# Altium schematic sheet 05_PWMdriver.SchDoc
size A
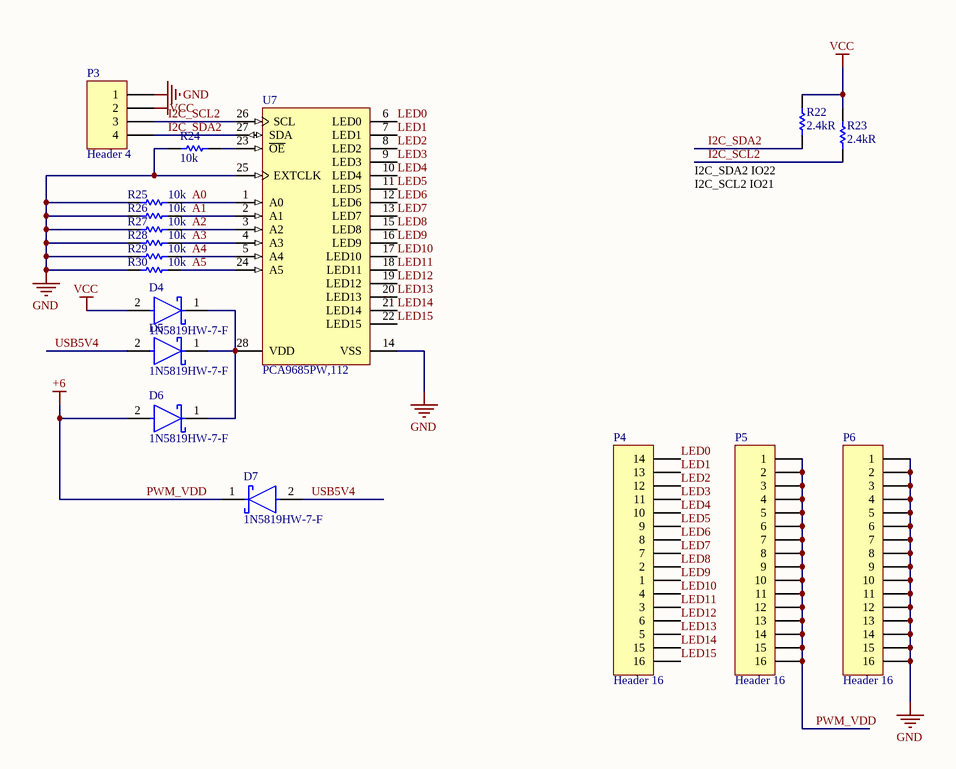
[diagram p0: 05_PWMdriver.SchDoc]

## Parts
D4  1N5819HW-7-F  [FP-SOD123-MFG]
D5  1N5819HW-7-F  [FP-SOD123-MFG]
D6  1N5819HW-7-F  [FP-SOD123-MFG]
D7  1N5819HW-7-F  [FP-SOD123-MFG]
P3  Header 4  [HDR1X4]
P4  Header 16  [HDR1X16]
P5  Header 16  [HDR1X16]
P6  Header 16  [HDR1X16]
R22  value 2.4kR  [RESC1608X50X30ML20T20]  (hidden comment: RR0816P-242-D)
R23  value 2.4kR  [RESC1608X50X30ML20T20]  (hidden comment: RR0816P-242-D)
R24  value 10k  [RESC1609X55X30LL15T15]  (hidden comment: ERJ3EKF1002V)
R25  value 10k  [RESC1609X55X30LL15T15]  (hidden comment: ERJ3EKF1002V)
R26  value 10k  [RESC1609X55X30LL15T15]  (hidden comment: ERJ3EKF1002V)
R27  value 10k  [RESC1609X55X30LL15T15]  (hidden comment: ERJ3EKF1002V)
R28  value 10k  [RESC1609X55X30LL15T15]  (hidden comment: ERJ3EKF1002V)
R29  value 10k  [RESC1609X55X30LL15T15]  (hidden comment: ERJ3EKF1002V)
R30  value 10k  [RESC1609X55X30LL15T15]  (hidden comment: ERJ3EKF1002V)
U7  PCA9685PW,112  [SOT361-1_V]

## Nets
GND: P3.1 P6.1 P6.2 P6.3 P6.4 P6.5 P6.6 P6.7 P6.8 P6.9 P6.10 P6.11 P6.12 P6.13 P6.14 P6.15 P6.16 R24.2 R25.2 R26.2 R27.2 R28.2 R29.2 R30.2 U7.14(VSS) U7.25(EXTCLK)
PWM_VDD: D6.2(A) D7.1(C) P5.1 P5.2 P5.3 P5.4 P5.5 P5.6 P5.7 P5.8 P5.9 P5.10 P5.11 P5.12 P5.13 P5.14 P5.15 P5.16  [also labelled +6]
VCC: D4.2(A) P3.2 R22.2 R23.2
A0: R25.1 U7.1(A0)
A1: R26.1 U7.2(A1)
A2: R27.1 U7.3(A2)
A3: R28.1 U7.4(A3)
A4: R29.1 U7.5(A4)
A5: R30.1 U7.24(A5)
I2C_SCL2: P3.3 R23.1 U7.26(SCL)
I2C_SDA2: P3.4 R22.1 U7.27(SDA)
LED0: P4.14 U7.6(LED0)
LED1: P4.13 U7.7(LED1)
LED2: P4.12 U7.8(LED2)
LED3: P4.11 U7.9(LED3)
LED4: P4.10 U7.10(LED4)
LED5: P4.9 U7.11(LED5)
LED6: P4.8 U7.12(LED6)
LED7: P4.7 U7.13(LED7)
LED8: P4.2 U7.15(LED8)
LED9: P4.1 U7.16(LED9)
LED10: P4.4 U7.17(LED10)
LED11: P4.3 U7.18(LED11)
LED12: P4.6 U7.19(LED12)
LED13: P4.5 U7.20(LED13)
LED14: P4.15 U7.21(LED14)
LED15: P4.16 U7.22(LED15)
USB5V4: D5.2(A) D7.2(A)
NetD4_1: D4.1(C) D5.1(C) D6.1(C) U7.28(VDD)
NetR24_1: R24.1 U7.23(~{OE})

## Notes on the sheet
- I2C_SDA2 IO22
  I2C_SCL2 IO21

## Library data of the parts
D4-D7 = CMP-12790-000018-1: DIODE SCHOTTKY 40V 1A SOD123; Manufacturer: Diodes Inc; Max Surge Forward Current: 25A; Peak Reverse Current: 1mA; Max Junction Temp: +125°C; Import Ts: 1521843113; Vr V: 40; Standoff Height: 0mm; Capacitance: 50pF; Value: 50pF; Ciiva Ids: 815630; If A: 1; Automotive: No; Device Class L1: Discrete Semiconductors; Octopart: https://octopart.com/1n5819hw-7-f-diodes+inc.-323197; Terminal Temperature Tt Degc: 90; ComponentLink2Description: Datasheet; Temperature Range High: +125°C; Package: SOD123; Reverse Voltage: 40V; Temperature Range Low: -65°C; Mouser Description: 1N5819HW Series 40 V 1 A Surface Mount Schottky Barrier Rectifier - SOD-123; Device Class L2: Diodes; Lead Free: Yes; Max Repetitive Reverse Voltage: 40V; Ipc Land Pattern Name: SOD365155X123-2; Forward Current: 1A; Device Class L3: Schottky Diodes; Digikey Description: DIODE SCHOTTKY 40V 1A SOD123; ComponentLink2URL: https://www.diodes.com/assets/Datasheets/ds30217.pdf; Footprint Url: https://www.diodes.com/assets/Package-Files/SOD123.pdf; RoHS: TRUE; Category: Diode; Height: 1.45mm; Release Date: 1385348939; Manufacturer Part Number: 1N5819HW-7-F; Temperature: -65°C to +125°C
P3 = Header 4: Header, 4-Pin; LatestRevisionDate: 17-Jul-2002; LatestRevisionNote: Re-released for DXP Platform.; Publisher: Altium Limited
P4-P6 = Header 16: Header, 16-Pin; LatestRevisionDate: 17-Jul-2002; LatestRevisionNote: Re-released for DXP Platform.; Publisher: Altium Limited
R22 R23 = CMP-2000-02561-1: Manufacturer: Susumu; Part Number: RR0816P-242-D
R24-R30 = CMP-2000-07452-1: Chip Resistor, 10 KOhm, +/- 1%, 0.1 W, -55 to 155 degC, 0603 (1608 Metric), RoHS, Tape and Reel; Manufacturer: Panasonic; Voltage Rating: 75V; Case\/Package: 0603; Power Rating: 100mW; Resistance: 10KOhm; Temperature Coefficient: 100ppm\/degreesC; Number of Pins: 2; Package Reference: 603; Depth: 0.8mm; Mount: SurfaceMount; Package Description: 2-Pin Surface Mount Device, Body 1.6 x 0.85 mm; Datasheet Version: 02/2017; Length: 1.6mm; Lead Free: LeadFree; Height: 0.45mm; Number of Terminations: 2; Max Power Dissipation: 100mW; Min Operating Temperature: -55degC; Datasheet URL: https://industrial.panasonic.com/cdbs/www-data/pdf/RDA0000/AOA0000C304.pdf; Termination: SMD/SMT; Case Code (Metric): 1608; Case Code (Imperial): 0603; Tolerance: 1%; Max Operating Temperature: 155degC; RoHSCompliant: true; Voltage Rating (DC): 75V; Radiation Hardening: No; Packaging: TapeandReel; Composition: ThickFilm; Mounting Technology: SurfaceMount; Manufacturer URL: http://www.panasonic.com/; Width: 0.031inch; REACH SVHC: NoSVHC; Contact Plating: Tin; Military Standard: Not; Package Quantity: 1
U7 = CMP-1595-00004-2: 16-Channel, 12-Bit PWM Fm+ I2C-Bus LED Controller, 2.3 to 5.5 V, -40 to 85 degC, 28-Pin TSSOP (SOT361-1), RoHS, Tape and Reel; Supply Current Max: 10 mA; Supply Voltage Min: 2.3 V; Supply Voltage Max: 5.5 V; Frequency: 25000000 Hz; Temperature Min: -40 degC; PackageDescription: 28-Pin Small Outline Package, Body 9.7 x 4.4 mm, Pitch 0.65 mm; RoHS: TRUE; ComponentLink1Description: Manufacturer URL; Code_JEDEC: MO-153; PartNumber: PCA9685; ComponentLink2URL: http://www.nxp.com/documents/data_sheet/PCA9685.pdf; Packing: Tape and Reel; ComponentLink1URL: http://www.nxp.com/; ComponentLink3Description: Package Specification; ComponentLink2Description: Datasheet; ComponentLink3URL: http://www.nxp.com/documents/outline_drawing/sot361-1_po.pdf; DatasheetVersion: Rev. 4; Temperature Max: 85 degC; PackageVersion: 02/2003; Mounting Technology: Surface Mount